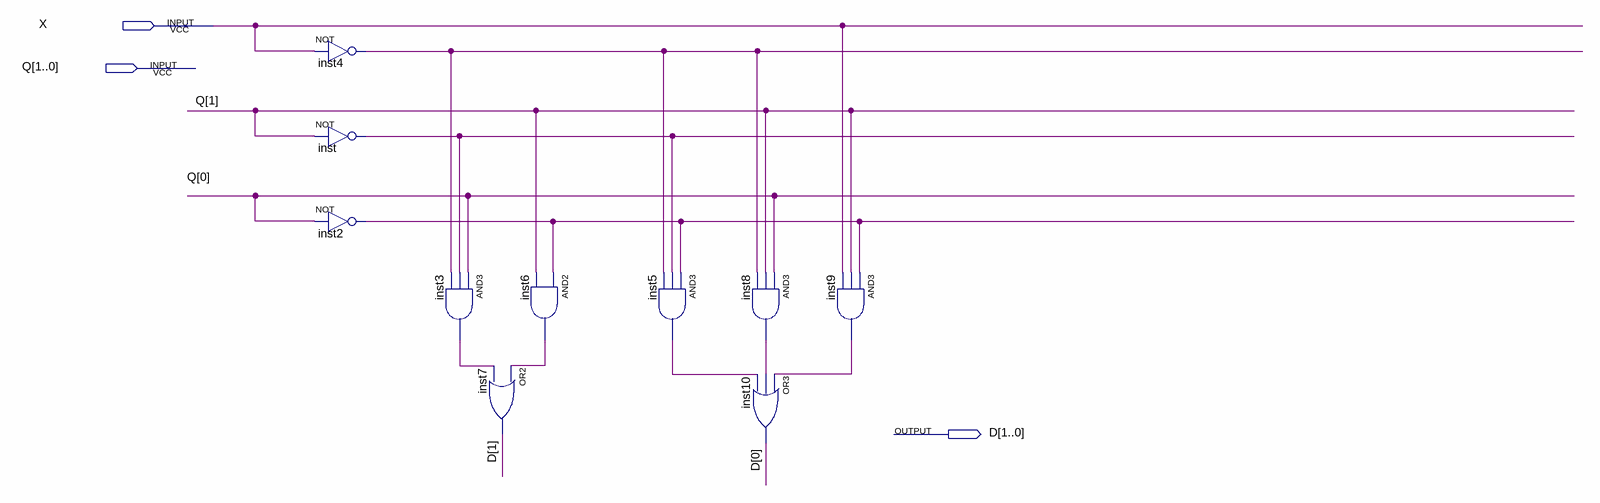
[diagram p0: schematic sheet]
// Quartus schematic NEXT_STATE.bdf as structural Verilog: 10 symbols, 3 pins
module NEXT_STATE (
  input  X,
  input  [1:0] Q,
  output [1:0] D
);

  wire inst2_out, inst3_out, inst4_out, inst5_out, inst6_out, inst8_out, inst9_out, inst_out;

  not inst4 (inst4_out, X);
  not inst (inst_out, Q[1]);
  not inst2 (inst2_out, Q[0]);
  and inst3 (inst3_out, Q[0], inst_out, inst4_out);
  or inst7 (D[1], inst6_out, inst3_out);
  and inst6 (inst6_out, inst2_out, Q[1]);
  and inst5 (inst5_out, inst2_out, inst_out, inst4_out);
  and inst8 (inst8_out, Q[0], Q[1], inst4_out);
  or inst10 (D[0], inst9_out, inst8_out, inst5_out);
  and inst9 (inst9_out, inst2_out, Q[1], X);
endmodule
